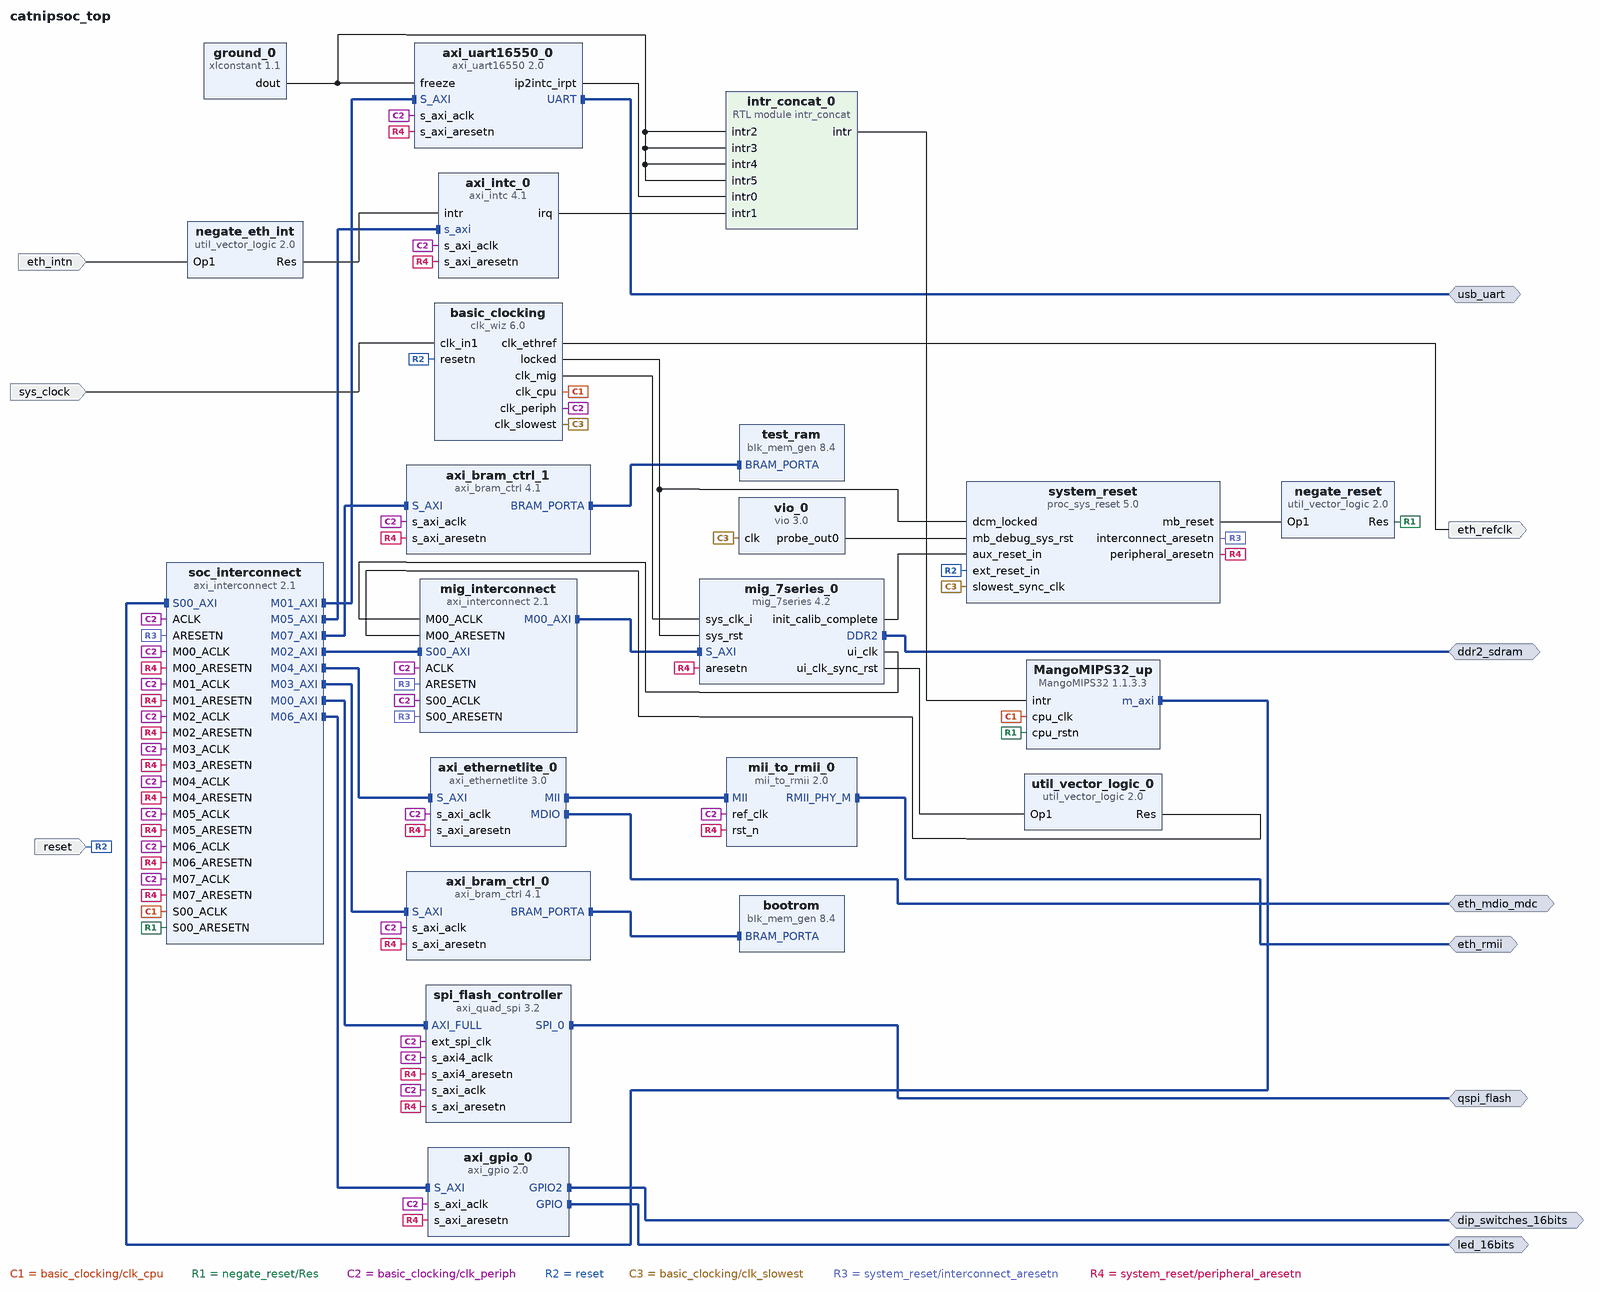
[diagram p0: block diagram of the top level]
# Vivado block design catnipsoc_top, xc7a100tcsg324-1, Vivado 2019.2
create_bd_design catnipsoc_top

create_bd_intf_port -mode Master -vlnv xilinx.com:interface:ddrx_rtl:1.0 ddr2_sdram
create_bd_intf_port -mode Master -vlnv xilinx.com:interface:uart_rtl:1.0 usb_uart
create_bd_intf_port -mode Master -vlnv xilinx.com:interface:spi_rtl:1.0 qspi_flash
create_bd_intf_port -mode Master -vlnv xilinx.com:interface:rmii_rtl:1.0 eth_rmii
create_bd_intf_port -mode Master -vlnv xilinx.com:interface:mdio_rtl:1.0 eth_mdio_mdc
create_bd_intf_port -mode Master -vlnv xilinx.com:interface:gpio_rtl:1.0 led_16bits
create_bd_intf_port -mode Master -vlnv xilinx.com:interface:gpio_rtl:1.0 dip_switches_16bits
create_bd_port -dir I -type clk sys_clock
set_property -dict {CONFIG.FREQ_HZ 100000000 CONFIG.PHASE 0.000} [get_bd_ports sys_clock]
create_bd_port -dir I -type rst reset
set_property -dict {CONFIG.POLARITY ACTIVE_LOW} [get_bd_ports reset]
create_bd_port -dir O -type clk eth_refclk
set_property -dict {CONFIG.FREQ_HZ 50000000} [get_bd_ports eth_refclk]
create_bd_port -dir I -type intr eth_intn
set_property -dict {CONFIG.SENSITIVITY LEVEL_LOW} [get_bd_ports eth_intn]

create_bd_cell -type ip -vlnv xilinx.com:ip:util_vector_logic:2.0 util_vector_logic_0
set_property -dict {CONFIG.C_OPERATION not CONFIG.C_SIZE 1} [get_bd_cells util_vector_logic_0]
create_bd_cell -type ip -vlnv xilinx.com:ip:util_vector_logic:2.0 negate_reset
set_property -dict {CONFIG.C_OPERATION not CONFIG.C_SIZE 1} [get_bd_cells negate_reset]
create_bd_cell -type ip -vlnv xilinx.com:ip:proc_sys_reset:5.0 system_reset
set_property -dict {CONFIG.RESET_BOARD_INTERFACE reset CONFIG.USE_BOARD_FLOW true} [get_bd_cells system_reset]
create_bd_cell -type ip -vlnv xilinx.com:ip:mii_to_rmii:2.0 mii_to_rmii_0
set_property -dict {CONFIG.RMII_BOARD_INTERFACE eth_rmii} [get_bd_cells mii_to_rmii_0]
create_bd_cell -type ip -vlnv xilinx.com:ip:util_vector_logic:2.0 negate_eth_int
set_property -dict {CONFIG.C_OPERATION not CONFIG.C_SIZE 1} [get_bd_cells negate_eth_int]
create_bd_cell -type module -reference intr_concat intr_concat_0
create_bd_cell -type ip -vlnv xilinx.com:ip:vio:3.0 vio_0
set_property -dict {CONFIG.C_NUM_PROBE_IN 0} [get_bd_cells vio_0]
create_bd_cell -type ip -vlnv xilinx.com:ip:axi_bram_ctrl:4.1 axi_bram_ctrl_0
set_property -dict {CONFIG.SINGLE_PORT_BRAM 1} [get_bd_cells axi_bram_ctrl_0]
create_bd_cell -type ip -vlnv xilinx.com:ip:axi_ethernetlite:3.0 axi_ethernetlite_0
set_property -dict {CONFIG.MDIO_BOARD_INTERFACE eth_mdio_mdc CONFIG.USE_BOARD_FLOW true} [get_bd_cells axi_ethernetlite_0]
create_bd_cell -type ip -vlnv xilinx.com:ip:axi_gpio:2.0 axi_gpio_0
set_property -dict [list \
  CONFIG.GPIO2_BOARD_INTERFACE dip_switches_16bits \
  CONFIG.GPIO_BOARD_INTERFACE led_16bits \
  CONFIG.USE_BOARD_FLOW true \
] [get_bd_cells axi_gpio_0]
create_bd_cell -type ip -vlnv xilinx.com:ip:axi_intc:4.1 axi_intc_0
set_property -dict [list \
  CONFIG.C_IRQ_CONNECTION 1 \
  CONFIG.C_PROCESSOR_CLK_FREQ_MHZ 50.0 \
  CONFIG.C_S_AXI_ACLK_FREQ_MHZ 50.0 \
] [get_bd_cells axi_intc_0]
create_bd_cell -type ip -vlnv xilinx.com:ip:axi_interconnect:2.1 soc_interconnect
set_property -dict {CONFIG.NUM_MI 8 CONFIG.S00_HAS_DATA_FIFO 2 CONFIG.STRATEGY 0} [get_bd_cells soc_interconnect]
create_bd_cell -type ip -vlnv xilinx.com:ip:axi_interconnect:2.1 mig_interconnect
set_property -dict [list \
  CONFIG.NUM_MI 1 \
  CONFIG.NUM_SI 1 \
  CONFIG.S00_HAS_DATA_FIFO 2 \
  CONFIG.S01_HAS_DATA_FIFO 2 \
  CONFIG.STRATEGY 0 \
] [get_bd_cells mig_interconnect]
create_bd_cell -type ip -vlnv xilinx.com:ip:axi_quad_spi:3.2 spi_flash_controller
set_property -dict [list \
  CONFIG.C_SPI_MEMORY 3 \
  CONFIG.C_SPI_MODE 0 \
  CONFIG.C_TYPE_OF_AXI4_INTERFACE 1 \
  CONFIG.C_XIP_MODE 1 \
  CONFIG.QSPI_BOARD_INTERFACE qspi_flash \
  CONFIG.USE_BOARD_FLOW true \
] [get_bd_cells spi_flash_controller]
create_bd_cell -type ip -vlnv xilinx.com:ip:axi_uart16550:2.0 axi_uart16550_0
set_property -dict [list \
  CONFIG.C_S_AXI_ACLK_FREQ_HZ 50000000 \
  CONFIG.UART_BOARD_INTERFACE usb_uart \
  CONFIG.USE_BOARD_FLOW true \
] [get_bd_cells axi_uart16550_0]
create_bd_cell -type ip -vlnv xilinx.com:ip:blk_mem_gen:8.4 bootrom
set_property -dict [list \
  CONFIG.Coe_File ../../../../cattery_bootloader.coe \
  CONFIG.Enable_32bit_Address true \
  CONFIG.Load_Init_File true \
  CONFIG.Memory_Type Single_Port_RAM \
  CONFIG.Port_A_Write_Rate 50 \
  CONFIG.Read_Width_A 32 \
  CONFIG.Register_PortA_Output_of_Memory_Primitives false \
  CONFIG.Use_RSTA_Pin false \
  CONFIG.Write_Depth_A 8192 \
  CONFIG.Write_Width_A 32 \
  CONFIG.use_bram_block Stand_Alone \
] [get_bd_cells bootrom]
create_bd_cell -type ip -vlnv xilinx.com:ip:clk_wiz:6.0 basic_clocking
set_property -dict [list \
  CONFIG.CLKOUT1_DRIVES BUFG \
  CONFIG.CLKOUT1_JITTER 151.636 \
  CONFIG.CLKOUT1_PHASE_ERROR 98.575 \
  CONFIG.CLKOUT1_REQUESTED_OUT_FREQ 50.000 \
  CONFIG.CLKOUT2_DRIVES BUFG \
  CONFIG.CLKOUT2_JITTER 151.636 \
  CONFIG.CLKOUT2_PHASE_ERROR 98.575 \
  CONFIG.CLKOUT2_REQUESTED_OUT_FREQ 50.000 \
  CONFIG.CLKOUT2_USED true \
  CONFIG.CLKOUT3_DRIVES BUFG \
  CONFIG.CLKOUT3_JITTER 151.636 \
  CONFIG.CLKOUT3_PHASE_ERROR 98.575 \
  CONFIG.CLKOUT3_REQUESTED_OUT_FREQ 50.000 \
  CONFIG.CLKOUT3_USED true \
  CONFIG.CLKOUT4_DRIVES BUFG \
  CONFIG.CLKOUT4_JITTER 114.829 \
  CONFIG.CLKOUT4_PHASE_ERROR 98.575 \
  CONFIG.CLKOUT4_REQUESTED_OUT_FREQ 200.000 \
  CONFIG.CLKOUT4_USED true \
  CONFIG.CLKOUT5_DRIVES BUFG \
  CONFIG.CLKOUT5_JITTER 151.636 \
  CONFIG.CLKOUT5_PHASE_ERROR 98.575 \
  CONFIG.CLKOUT5_REQUESTED_OUT_FREQ 50.000 \
  CONFIG.CLKOUT5_REQUESTED_PHASE -22.500 \
  CONFIG.CLKOUT5_USED true \
  CONFIG.CLKOUT6_DRIVES BUFG \
  CONFIG.CLKOUT6_JITTER 145.943 \
  CONFIG.CLKOUT6_PHASE_ERROR 94.994 \
  CONFIG.CLKOUT6_REQUESTED_OUT_FREQ 100.000 \
  CONFIG.CLKOUT6_REQUESTED_PHASE 0.000 \
  CONFIG.CLKOUT6_USED false \
  CONFIG.CLKOUT7_DRIVES BUFG \
  CONFIG.CLK_IN1_BOARD_INTERFACE sys_clock \
  CONFIG.CLK_OUT1_PORT clk_slowest \
  CONFIG.CLK_OUT2_PORT clk_cpu \
  CONFIG.CLK_OUT3_PORT clk_periph \
  CONFIG.CLK_OUT4_PORT clk_mig \
  CONFIG.CLK_OUT5_PORT clk_ethref \
  CONFIG.CLK_OUT6_PORT clk_out6 \
  CONFIG.FEEDBACK_SOURCE FDBK_AUTO \
  CONFIG.MMCM_CLKFBOUT_MULT_F 10.000 \
  CONFIG.MMCM_CLKOUT0_DIVIDE_F 20.000 \
  CONFIG.MMCM_CLKOUT1_DIVIDE 20 \
  CONFIG.MMCM_CLKOUT2_DIVIDE 20 \
  CONFIG.MMCM_CLKOUT3_DIVIDE 5 \
  CONFIG.MMCM_CLKOUT4_DIVIDE 20 \
  CONFIG.MMCM_CLKOUT4_PHASE -22.500 \
  CONFIG.MMCM_CLKOUT5_DIVIDE 1 \
  CONFIG.MMCM_CLKOUT5_PHASE 0.000 \
  CONFIG.MMCM_COMPENSATION ZHOLD \
  CONFIG.MMCM_DIVCLK_DIVIDE 1 \
  CONFIG.NUM_OUT_CLKS 5 \
  CONFIG.PRIMITIVE MMCM \
  CONFIG.RESET_BOARD_INTERFACE reset \
  CONFIG.RESET_PORT resetn \
  CONFIG.RESET_TYPE ACTIVE_LOW \
  CONFIG.USE_BOARD_FLOW true \
] [get_bd_cells basic_clocking]
create_bd_cell -type ip -vlnv xilinx.com:ip:xlconstant:1.1 ground_0
set_property -dict {CONFIG.CONST_VAL 0} [get_bd_cells ground_0]
create_bd_cell -type ip -vlnv xilinx.com:ip:mig_7series:4.2 mig_7series_0
set_property -dict {CONFIG.BOARD_MIG_PARAM ddr2_sdram CONFIG.XML_INPUT_FILE board.prj} [get_bd_cells mig_7series_0]
create_bd_cell -type ip -vlnv xilinx.com:ip:axi_bram_ctrl:4.1 axi_bram_ctrl_1
set_property -dict {CONFIG.SINGLE_PORT_BRAM 1} [get_bd_cells axi_bram_ctrl_1]
create_bd_cell -type ip -vlnv xilinx.com:ip:blk_mem_gen:8.4 test_ram
set_property -dict [list \
  CONFIG.Enable_32bit_Address true \
  CONFIG.Load_Init_File false \
  CONFIG.Memory_Type Single_Port_ROM \
  CONFIG.Port_A_Write_Rate 0 \
  CONFIG.Register_PortA_Output_of_Memory_Primitives false \
  CONFIG.Use_RSTA_Pin false \
  CONFIG.Write_Depth_A 8192 \
  CONFIG.Write_Width_A 32 \
  CONFIG.use_bram_block Stand_Alone \
] [get_bd_cells test_ram]
create_bd_cell -type ip -vlnv xilinx.com:user:MangoMIPS32:1.1.3.3 MangoMIPS32_up

# ---- connections ----

connect_bd_intf_net [get_bd_intf_pins soc_interconnect/M07_AXI] [get_bd_intf_pins axi_bram_ctrl_1/S_AXI]
connect_bd_intf_net [get_bd_intf_ports qspi_flash] [get_bd_intf_pins spi_flash_controller/SPI_0]
connect_bd_intf_net [get_bd_intf_ports ddr2_sdram] [get_bd_intf_pins mig_7series_0/DDR2]
connect_bd_intf_net [get_bd_intf_ports dip_switches_16bits] [get_bd_intf_pins axi_gpio_0/GPIO2]
connect_bd_intf_net [get_bd_intf_pins soc_interconnect/M02_AXI] [get_bd_intf_pins mig_interconnect/S00_AXI]
connect_bd_intf_net [get_bd_intf_pins soc_interconnect/M05_AXI] [get_bd_intf_pins axi_intc_0/s_axi]
connect_bd_intf_net -intf_net axi_interconnect_0_M00_AXI [get_bd_intf_pins mig_7series_0/S_AXI] [get_bd_intf_pins mig_interconnect/M00_AXI]
connect_bd_intf_net [get_bd_intf_ports eth_rmii] [get_bd_intf_pins mii_to_rmii_0/RMII_PHY_M]
connect_bd_intf_net [get_bd_intf_pins bootrom/BRAM_PORTA] [get_bd_intf_pins axi_bram_ctrl_0/BRAM_PORTA]
connect_bd_intf_net [get_bd_intf_pins spi_flash_controller/AXI_FULL] [get_bd_intf_pins soc_interconnect/M00_AXI]
connect_bd_intf_net -intf_net axi_uart16550_1_UART [get_bd_intf_ports usb_uart] [get_bd_intf_pins axi_uart16550_0/UART]
connect_bd_intf_net [get_bd_intf_ports eth_mdio_mdc] [get_bd_intf_pins axi_ethernetlite_0/MDIO]
connect_bd_intf_net [get_bd_intf_pins axi_bram_ctrl_1/BRAM_PORTA] [get_bd_intf_pins test_ram/BRAM_PORTA]
connect_bd_intf_net [get_bd_intf_pins axi_bram_ctrl_0/S_AXI] [get_bd_intf_pins soc_interconnect/M03_AXI]
connect_bd_intf_net [get_bd_intf_pins axi_ethernetlite_0/S_AXI] [get_bd_intf_pins soc_interconnect/M04_AXI]
connect_bd_intf_net [get_bd_intf_pins soc_interconnect/M01_AXI] [get_bd_intf_pins axi_uart16550_0/S_AXI]
connect_bd_intf_net [get_bd_intf_ports led_16bits] [get_bd_intf_pins axi_gpio_0/GPIO]
connect_bd_intf_net -intf_net MangoMIPS32_0_m_axi [get_bd_intf_pins MangoMIPS32_up/m_axi] [get_bd_intf_pins soc_interconnect/S00_AXI]
connect_bd_intf_net [get_bd_intf_pins axi_gpio_0/S_AXI] [get_bd_intf_pins soc_interconnect/M06_AXI]
connect_bd_intf_net [get_bd_intf_pins axi_ethernetlite_0/MII] [get_bd_intf_pins mii_to_rmii_0/MII]
connect_bd_net -net clk_wiz_0_clk_cpu [get_bd_pins basic_clocking/clk_cpu] \
  [get_bd_pins soc_interconnect/S00_ACLK] [get_bd_pins MangoMIPS32_up/cpu_clk]
connect_bd_net [get_bd_pins negate_reset/Res] [get_bd_pins soc_interconnect/S00_ARESETN] [get_bd_pins MangoMIPS32_up/cpu_rstn]
connect_bd_net -net clk_wiz_0_clk_periph [get_bd_pins basic_clocking/clk_periph] \
  [get_bd_pins mii_to_rmii_0/ref_clk] [get_bd_pins axi_bram_ctrl_0/s_axi_aclk] [get_bd_pins axi_ethernetlite_0/s_axi_aclk] \
  [get_bd_pins axi_gpio_0/s_axi_aclk] [get_bd_pins axi_intc_0/s_axi_aclk] [get_bd_pins soc_interconnect/ACLK] \
  [get_bd_pins soc_interconnect/M00_ACLK] [get_bd_pins soc_interconnect/M01_ACLK] [get_bd_pins soc_interconnect/M02_ACLK] \
  [get_bd_pins soc_interconnect/M03_ACLK] [get_bd_pins soc_interconnect/M04_ACLK] [get_bd_pins soc_interconnect/M05_ACLK] \
  [get_bd_pins soc_interconnect/M06_ACLK] [get_bd_pins mig_interconnect/ACLK] [get_bd_pins mig_interconnect/S00_ACLK] \
  [get_bd_pins spi_flash_controller/s_axi_aclk] [get_bd_pins spi_flash_controller/s_axi4_aclk] \
  [get_bd_pins axi_uart16550_0/s_axi_aclk] [get_bd_pins axi_bram_ctrl_1/s_axi_aclk] [get_bd_pins soc_interconnect/M07_ACLK] \
  [get_bd_pins spi_flash_controller/ext_spi_clk]
connect_bd_net [get_bd_ports reset] [get_bd_pins system_reset/ext_reset_in] [get_bd_pins basic_clocking/resetn]
connect_bd_net -net M02_ACLK_1 [get_bd_pins mig_7series_0/ui_clk] [get_bd_pins mig_interconnect/M00_ACLK]
connect_bd_net [get_bd_pins mig_7series_0/ui_clk_sync_rst] [get_bd_pins util_vector_logic_0/Op1]
connect_bd_net -net proc_sys_reset_0_mb_reset [get_bd_pins system_reset/mb_reset] [get_bd_pins negate_reset/Op1]
connect_bd_net -net clk_wiz_0_clk_slowest [get_bd_pins basic_clocking/clk_slowest] [get_bd_pins system_reset/slowest_sync_clk] [get_bd_pins vio_0/clk]
connect_bd_net -net constant_0_dout [get_bd_pins ground_0/dout] \
  [get_bd_pins intr_concat_0/intr2] [get_bd_pins intr_concat_0/intr3] [get_bd_pins intr_concat_0/intr4] \
  [get_bd_pins intr_concat_0/intr5] [get_bd_pins axi_uart16550_0/freeze]
connect_bd_net -net clk_wiz_0_locked [get_bd_pins basic_clocking/locked] [get_bd_pins system_reset/dcm_locked] [get_bd_pins mig_7series_0/sys_rst]
connect_bd_net [get_bd_pins mig_7series_0/init_calib_complete] [get_bd_pins system_reset/aux_reset_in]
connect_bd_net [get_bd_ports sys_clock] [get_bd_pins basic_clocking/clk_in1]
connect_bd_net -net ARESETN_1 [get_bd_pins system_reset/interconnect_aresetn] \
  [get_bd_pins soc_interconnect/ARESETN] [get_bd_pins mig_interconnect/ARESETN] [get_bd_pins mig_interconnect/S00_ARESETN]
connect_bd_net -net proc_sys_reset_0_peripheral_aresetn [get_bd_pins system_reset/peripheral_aresetn] \
  [get_bd_pins mii_to_rmii_0/rst_n] [get_bd_pins axi_bram_ctrl_0/s_axi_aresetn] \
  [get_bd_pins axi_ethernetlite_0/s_axi_aresetn] [get_bd_pins axi_gpio_0/s_axi_aresetn] \
  [get_bd_pins axi_intc_0/s_axi_aresetn] [get_bd_pins soc_interconnect/M00_ARESETN] \
  [get_bd_pins soc_interconnect/M01_ARESETN] [get_bd_pins soc_interconnect/M02_ARESETN] \
  [get_bd_pins soc_interconnect/M03_ARESETN] [get_bd_pins soc_interconnect/M04_ARESETN] \
  [get_bd_pins soc_interconnect/M05_ARESETN] [get_bd_pins soc_interconnect/M06_ARESETN] \
  [get_bd_pins spi_flash_controller/s_axi_aresetn] [get_bd_pins spi_flash_controller/s_axi4_aresetn] \
  [get_bd_pins axi_uart16550_0/s_axi_aresetn] [get_bd_pins mig_7series_0/aresetn] [get_bd_pins soc_interconnect/M07_ARESETN] \
  [get_bd_pins axi_bram_ctrl_1/s_axi_aresetn]
connect_bd_net [get_bd_pins util_vector_logic_0/Res] [get_bd_pins mig_interconnect/M00_ARESETN]
connect_bd_net -net clocking_unit_clk_ethref [get_bd_pins basic_clocking/clk_ethref] [get_bd_ports eth_refclk]
connect_bd_net -net clocking_unit_clk_mig [get_bd_pins basic_clocking/clk_mig] [get_bd_pins mig_7series_0/sys_clk_i]
connect_bd_net [get_bd_ports eth_intn] [get_bd_pins negate_eth_int/Op1]
connect_bd_net -net negate_reset1_Res [get_bd_pins negate_eth_int/Res] [get_bd_pins axi_intc_0/intr]
connect_bd_net [get_bd_pins axi_uart16550_0/ip2intc_irpt] [get_bd_pins intr_concat_0/intr0]
connect_bd_net [get_bd_pins axi_intc_0/irq] [get_bd_pins intr_concat_0/intr1]
connect_bd_net [get_bd_pins vio_0/probe_out0] [get_bd_pins system_reset/mb_debug_sys_rst]
connect_bd_net [get_bd_pins intr_concat_0/intr] [get_bd_pins MangoMIPS32_up/intr]

# ---- address map ----
assign_bd_address -offset 0x00000000 -range 128M -target_address_space [get_bd_addr_spaces MangoMIPS32_up/m_axi] [get_bd_addr_segs mig_7series_0/memmap/memaddr]
assign_bd_address -offset 0x10200000 -range 64K -target_address_space [get_bd_addr_spaces MangoMIPS32_up/m_axi] [get_bd_addr_segs axi_intc_0/S_AXI/Reg]
assign_bd_address -offset 0x10400000 -range 64K -target_address_space [get_bd_addr_spaces MangoMIPS32_up/m_axi] [get_bd_addr_segs axi_uart16550_0/S_AXI/Reg]
assign_bd_address -offset 0x10600000 -range 64K -target_address_space [get_bd_addr_spaces MangoMIPS32_up/m_axi] [get_bd_addr_segs axi_gpio_0/S_AXI/Reg]
assign_bd_address -offset 0x10E00000 -range 64K -target_address_space [get_bd_addr_spaces MangoMIPS32_up/m_axi] [get_bd_addr_segs axi_ethernetlite_0/S_AXI/Reg]
assign_bd_address -offset 0x1D000000 -range 16M -target_address_space [get_bd_addr_spaces MangoMIPS32_up/m_axi] [get_bd_addr_segs spi_flash_controller/aximm/MEM0]
assign_bd_address -offset 0x1E000000 -range 64K -target_address_space [get_bd_addr_spaces MangoMIPS32_up/m_axi] [get_bd_addr_segs axi_bram_ctrl_1/S_AXI/Mem0]
assign_bd_address -offset 0x1FC00000 -range 1M -target_address_space [get_bd_addr_spaces MangoMIPS32_up/m_axi] [get_bd_addr_segs axi_bram_ctrl_0/S_AXI/Mem0]

validate_bd_design
save_bd_design
